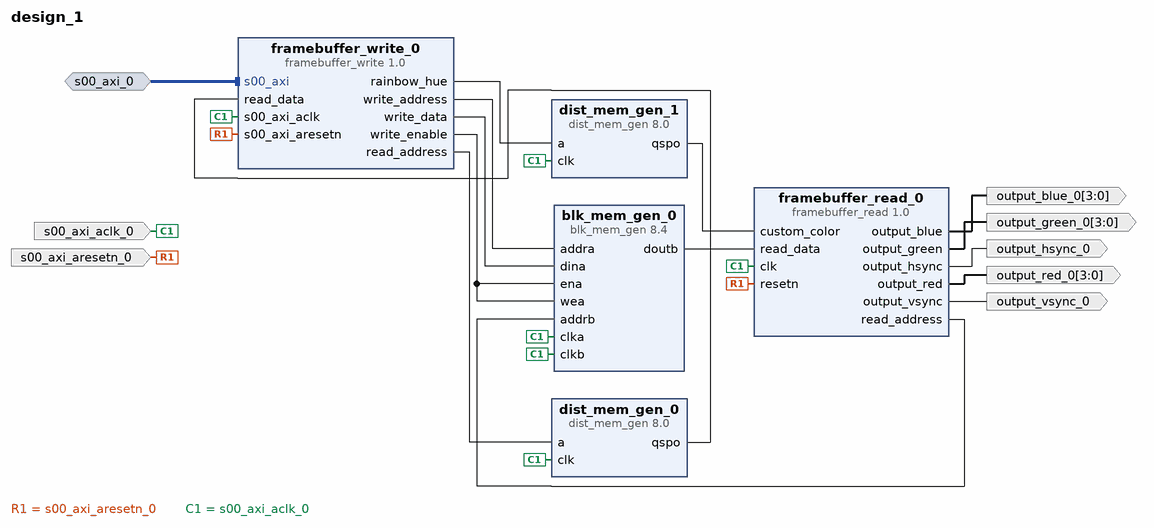
[diagram p0: block diagram of the top level]
# Vivado block design design_1, xc7a100tcsg324-1, Vivado 2018.1
create_bd_design design_1

create_bd_intf_port -mode Slave -vlnv xilinx.com:interface:aximm_rtl:1.0 s00_axi_0
set_property -dict [list \
  CONFIG.DATA_WIDTH 32 \
  CONFIG.PROTOCOL AXI4LITE \
  CONFIG.ID_WIDTH 0 \
  CONFIG.ADDR_WIDTH 32 \
  CONFIG.AWUSER_WIDTH 0 \
  CONFIG.ARUSER_WIDTH 0 \
  CONFIG.WUSER_WIDTH 0 \
  CONFIG.RUSER_WIDTH 0 \
  CONFIG.BUSER_WIDTH 0 \
  CONFIG.READ_WRITE_MODE READ_WRITE \
  CONFIG.HAS_BURST 0 \
  CONFIG.HAS_LOCK 0 \
  CONFIG.HAS_PROT 1 \
  CONFIG.HAS_CACHE 0 \
  CONFIG.HAS_QOS 0 \
  CONFIG.HAS_REGION 0 \
  CONFIG.HAS_WSTRB 1 \
  CONFIG.HAS_BRESP 1 \
  CONFIG.HAS_RRESP 1 \
  CONFIG.SUPPORTS_NARROW_BURST 0 \
  CONFIG.NUM_READ_OUTSTANDING 1 \
  CONFIG.NUM_WRITE_OUTSTANDING 1 \
  CONFIG.MAX_BURST_LENGTH 1 \
  CONFIG.CLK_DOMAIN design_1_s00_axi_aclk_0 \
  CONFIG.NUM_READ_THREADS 1 \
  CONFIG.NUM_WRITE_THREADS 1 \
  CONFIG.RUSER_BITS_PER_BYTE 0 \
  CONFIG.WUSER_BITS_PER_BYTE 0 \
] [get_bd_intf_ports s00_axi_0]
create_bd_port -dir I -type rst s00_axi_aresetn_0
set_property -dict {CONFIG.POLARITY ACTIVE_LOW} [get_bd_ports s00_axi_aresetn_0]
create_bd_port -dir O output_hsync_0
create_bd_port -dir I -type clk s00_axi_aclk_0
set_property -dict {CONFIG.ASSOCIATED_BUSIF s00_axi_0 CONFIG.ASSOCIATED_RESET s00_axi_aresetn_0} [get_bd_ports s00_axi_aclk_0]
create_bd_port -dir O -from 3 -to 0 output_green_0
create_bd_port -dir O -from 3 -to 0 output_blue_0
create_bd_port -dir O output_vsync_0
create_bd_port -dir O -from 3 -to 0 output_red_0

create_bd_cell -type ip -vlnv xilinx.com:user:framebuffer_write:1.0 framebuffer_write_0
create_bd_cell -type ip -vlnv xilinx.com:ip:blk_mem_gen:8.4 blk_mem_gen_0
set_property -dict [list \
  CONFIG.Memory_Type Simple_Dual_Port_RAM \
  CONFIG.Enable_32bit_Address false \
  CONFIG.Use_Byte_Write_Enable false \
  CONFIG.Assume_Synchronous_Clk true \
  CONFIG.Write_Width_A 13 \
  CONFIG.Write_Depth_A 307200 \
  CONFIG.Operating_Mode_A READ_FIRST \
  CONFIG.Write_Width_B 13 \
  CONFIG.Read_Width_B 13 \
  CONFIG.Enable_B Always_Enabled \
  CONFIG.Register_PortB_Output_of_Memory_Primitives false \
  CONFIG.Load_Init_File true \
  CONFIG.Coe_File ../../../../../../../background.coe \
  CONFIG.Fill_Remaining_Memory_Locations true \
  CONFIG.Use_RSTB_Pin false \
  CONFIG.Port_B_Clock 100 \
  CONFIG.Port_B_Enable_Rate 100 \
  CONFIG.use_bram_block Stand_Alone \
] [get_bd_cells blk_mem_gen_0]
create_bd_cell -type ip -vlnv xilinx.com:user:framebuffer_read:1.0 framebuffer_read_0
create_bd_cell -type ip -vlnv xilinx.com:ip:dist_mem_gen:8.0 dist_mem_gen_0
set_property -dict [list \
  CONFIG.depth 1104 \
  CONFIG.data_width 1 \
  CONFIG.memory_type rom \
  CONFIG.input_options non_registered \
  CONFIG.output_options registered \
  CONFIG.single_port_output_clock_enable false \
  CONFIG.coefficient_file ../../../../../../../circle_LUT.coe \
  CONFIG.default_data_radix 2 \
  CONFIG.reset_qspo false \
  CONFIG.sync_reset_qspo false \
] [get_bd_cells dist_mem_gen_0]
create_bd_cell -type ip -vlnv xilinx.com:ip:dist_mem_gen:8.0 dist_mem_gen_1
set_property -dict [list \
  CONFIG.depth 96 \
  CONFIG.data_width 12 \
  CONFIG.memory_type rom \
  CONFIG.output_options registered \
  CONFIG.coefficient_file ../../../../../../../color_LUT.coe \
  CONFIG.default_data_radix 2 \
  CONFIG.reset_qspo false \
  CONFIG.sync_reset_qspo false \
] [get_bd_cells dist_mem_gen_1]

# ---- connections ----

connect_bd_intf_net -intf_net s00_axi_0_1 [get_bd_intf_ports s00_axi_0] [get_bd_intf_pins framebuffer_write_0/s00_axi]
connect_bd_net [get_bd_pins framebuffer_write_0/rainbow_hue] [get_bd_pins dist_mem_gen_1/a]
connect_bd_net [get_bd_pins framebuffer_write_0/read_address] [get_bd_pins dist_mem_gen_0/a]
connect_bd_net [get_bd_pins framebuffer_write_0/write_address] [get_bd_pins blk_mem_gen_0/addra]
connect_bd_net [get_bd_pins framebuffer_write_0/write_data] [get_bd_pins blk_mem_gen_0/dina]
connect_bd_net [get_bd_pins framebuffer_write_0/write_enable] [get_bd_pins blk_mem_gen_0/wea] [get_bd_pins blk_mem_gen_0/ena]
connect_bd_net [get_bd_pins framebuffer_read_0/read_address] [get_bd_pins blk_mem_gen_0/addrb]
connect_bd_net [get_bd_pins blk_mem_gen_0/doutb] [get_bd_pins framebuffer_read_0/read_data]
connect_bd_net -net s00_axi_aresetn_0_1 [get_bd_ports s00_axi_aresetn_0] \
  [get_bd_pins framebuffer_write_0/s00_axi_aresetn] [get_bd_pins framebuffer_read_0/resetn]
connect_bd_net [get_bd_pins framebuffer_read_0/output_hsync] [get_bd_ports output_hsync_0]
connect_bd_net -net s00_axi_aclk_0_1 [get_bd_ports s00_axi_aclk_0] \
  [get_bd_pins blk_mem_gen_0/clkb] [get_bd_pins blk_mem_gen_0/clka] [get_bd_pins framebuffer_write_0/s00_axi_aclk] \
  [get_bd_pins framebuffer_read_0/clk] [get_bd_pins dist_mem_gen_1/clk] [get_bd_pins dist_mem_gen_0/clk]
connect_bd_net [get_bd_pins framebuffer_read_0/output_green] [get_bd_ports output_green_0]
connect_bd_net [get_bd_pins framebuffer_read_0/output_blue] [get_bd_ports output_blue_0]
connect_bd_net [get_bd_pins framebuffer_read_0/output_vsync] [get_bd_ports output_vsync_0]
connect_bd_net [get_bd_pins framebuffer_read_0/output_red] [get_bd_ports output_red_0]
connect_bd_net [get_bd_pins dist_mem_gen_1/qspo] [get_bd_pins framebuffer_read_0/custom_color]
connect_bd_net [get_bd_pins dist_mem_gen_0/qspo] [get_bd_pins framebuffer_write_0/read_data]

# ---- address map ----
assign_bd_address -offset 0x00000000 -range 4K -target_address_space [get_bd_addr_spaces s00_axi_0] [get_bd_addr_segs framebuffer_write_0/s00_axi/reg0]

validate_bd_design
save_bd_design
